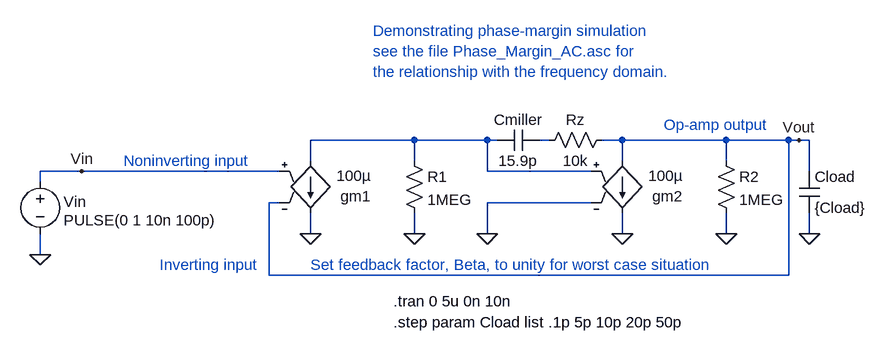
[diagram p0: schematic Phase_Margin_tran.asc]
Phase_Margin_tran.asc, the LTspice schematic file:
Version 4
SHEET 1 2900 680
WIRE 1616 -160 1616 -176
WIRE 1616 -48 1616 -80
WIRE 1680 -176 1616 -176
WIRE 1968 -16 1968 -128
WIRE 1984 -176 1680 -176
WIRE 1984 -128 1968 -128
WIRE 2032 -192 2032 -224
WIRE 2032 -80 2032 -112
WIRE 2192 -224 2032 -224
WIRE 2192 -192 2192 -224
WIRE 2192 -80 2192 -112
WIRE 2304 -224 2192 -224
WIRE 2304 -176 2304 -224
WIRE 2304 -80 2304 -128
WIRE 2320 -224 2304 -224
WIRE 2400 -224 2384 -224
WIRE 2464 -176 2304 -176
WIRE 2464 -128 2304 -128
WIRE 2512 -224 2480 -224
WIRE 2512 -192 2512 -224
WIRE 2512 -80 2512 -112
WIRE 2672 -224 2512 -224
WIRE 2672 -192 2672 -224
WIRE 2672 -80 2672 -112
WIRE 2768 -224 2672 -224
WIRE 2768 -16 1968 -16
WIRE 2768 -16 2768 -224
WIRE 2784 -224 2768 -224
WIRE 2800 -224 2784 -224
WIRE 2800 -176 2800 -224
WIRE 2800 -80 2800 -112
FLAG 2800 -80 0
FLAG 2784 -224 Vout
FLAG 2512 -80 0
FLAG 2672 -80 0
FLAG 2032 -80 0
FLAG 2192 -80 0
FLAG 2304 -80 0
FLAG 1616 -48 0
FLAG 1680 -176 Vin
SYMBOL cap 2784 -176 R0
SYMATTR InstName Cload
SYMATTR Value {Cload}
SYMBOL g2 2512 -96 M180
WINDOW 0 46 42 Left 0
WINDOW 3 40 73 Left 0
SYMATTR InstName gm2
SYMATTR Value 100µ
SYMBOL res 2656 -208 R0
SYMATTR InstName R2
SYMATTR Value 1MEG
SYMBOL g2 2032 -96 M180
WINDOW 0 46 42 Left 0
WINDOW 3 40 73 Left 0
SYMATTR InstName gm1
SYMATTR Value 100µ
SYMBOL res 2176 -208 R0
SYMATTR InstName R1
SYMATTR Value 1MEG
SYMBOL cap 2320 -208 R270
WINDOW 0 32 32 VTop 0
WINDOW 3 0 32 VBottom 0
SYMATTR InstName Cmiller
SYMATTR Value 15.9p
SYMBOL voltage 1616 -176 R0
WINDOW 0 36 47 Left 0
WINDOW 39 0 0 Left 0
WINDOW 3 36 75 Left 0
SYMATTR InstName Vin
SYMATTR Value PULSE(0 1 10n 100p)
SYMATTR Value2 AC 1
SYMBOL res 2384 -208 R270
WINDOW 0 32 56 VTop 0
WINDOW 3 0 56 VBottom 0
SYMATTR InstName Rz
SYMATTR Value 10k
TEXT 2160 24 Left 0 !.tran 0 5u 0n 10n
TEXT 1744 -192 Left 0 ;Noninverting input
TEXT 1800 -32 Left 0 ;Inverting input
TEXT 2576 -248 Left 0 ;Op-amp output
TEXT 2128 -392 Left 0 ;Demonstrating phase-margin simulation\nsee the file Phase_Margin_AC.asc for\nthe relationship with the frequency domain.
TEXT 2160 56 Left 0 !.step param Cload list .1p 5p 10p 20p 50p
TEXT 2032 -32 Left 0 ;Set feedback factor, Beta, to unity for worst case situation

The netlist it stands for:
* Phase_Margin_tran.asc
Cload Vout 0 {Cload}
gm2 Vout 0 N001 0 100µ
R2 Vout 0 1MEG
gm1 N001 0 Vin Vout 100µ
R1 N001 0 1MEG
Cmiller N001 N002 15.9p
Vin Vin 0 PULSE(0 1 10n 100p) AC 1
Rz N002 Vout 10k
.tran 0 5u 0n 10n
* Noninverting input
* Inverting input
* Op-amp output
* Demonstrating phase-margin simulation
* see the file Phase_Margin_AC.asc for
* the relationship with the frequency domain.
.step param Cload list .1p 5p 10p 20p 50p
* Set feedback factor, Beta, to unity for worst case situation
.backanno
.end